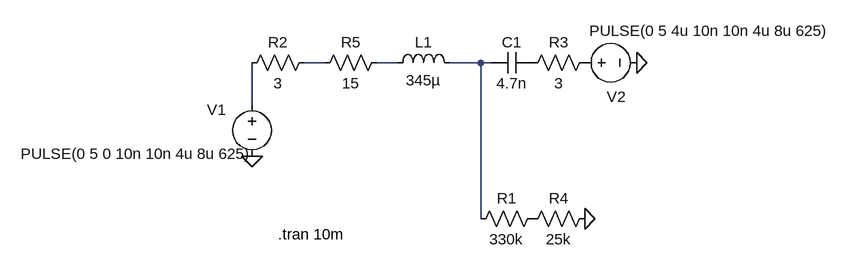
[diagram p0: schematic rfid.asc]
rfid.asc, the LTspice schematic file:
Version 4.1
SHEET 1 2028 680
WIRE 176 64 144 64
WIRE 288 64 256 64
WIRE 416 64 368 64
WIRE 432 64 416 64
WIRE 64 128 64 64
WIRE 416 304 416 64
FLAG 64 208 0
FLAG 656 64 0
FLAG 576 304 0
SYMBOL voltage 64 112 R0
WINDOW 0 -69 24 Left 2
WINDOW 3 -356 92 Left 2
WINDOW 123 0 0 Left 0
WINDOW 39 0 0 Left 0
SYMATTR InstName V1
SYMATTR Value PULSE(0 5 0 10n 10n 4u 8u 625)
SYMBOL ind 272 80 R270
WINDOW 0 32 56 VTop 2
WINDOW 3 5 56 VBottom 2
SYMATTR InstName L1
SYMATTR Value 345µ
SYMATTR SpiceLine Rser=2
SYMBOL cap 496 48 R90
WINDOW 0 0 32 VBottom 2
WINDOW 3 32 32 VTop 2
SYMATTR InstName C1
SYMATTR Value 4.7n
SYMBOL res 512 288 R90
WINDOW 0 0 56 VBottom 2
WINDOW 3 32 56 VTop 2
SYMATTR InstName R1
SYMATTR Value 330k
SYMBOL res 160 48 R90
WINDOW 0 0 56 VBottom 2
WINDOW 3 32 56 VTop 2
SYMATTR InstName R2
SYMATTR Value 3
SYMBOL voltage 560 64 R270
WINDOW 0 -52 50 VRight 2
WINDOW 3 49 23 VRight 2
WINDOW 123 0 0 Left 0
WINDOW 39 0 0 Left 0
SYMATTR InstName V2
SYMATTR Value PULSE(0 5 4u 10n 10n 4u 8u 625)
SYMBOL res 592 48 R90
WINDOW 0 0 56 VBottom 2
WINDOW 3 32 56 VTop 2
SYMATTR InstName R3
SYMATTR Value 3
SYMBOL res 592 288 R90
WINDOW 0 0 56 VBottom 2
WINDOW 3 32 56 VTop 2
SYMATTR InstName R4
SYMATTR Value 25k
SYMBOL res 272 48 R90
WINDOW 0 0 56 VBottom 2
WINDOW 3 32 56 VTop 2
SYMATTR InstName R5
SYMATTR Value 15
TEXT 104 328 Left 2 !.tran 10m

The netlist it stands for:
* rfid.asc
V1 N004 0 PULSE(0 5 0 10n 10n 4u 8u 625)
L1 N002 N003 345µ Rser=2
C1 P001 N003 4.7n
R1 P002 N003 330k
R2 N001 N004 3
V2 P003 0 PULSE(0 5 4u 10n 10n 4u 8u 625)
R3 P003 P001 3
R4 0 P002 25k
R5 N002 N001 15
.tran 10m
.backanno
.end